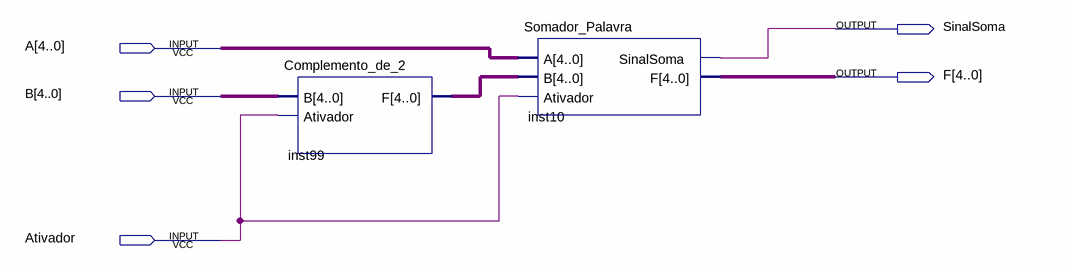
[diagram p0: schematic sheet]
// Quartus schematic Subtrator_Palavra.bdf as structural Verilog: 2 symbols, 5 pins
module Subtrator_Palavra (
  input  [4:0] A,
  input  [4:0] B,
  input  Ativador,
  output SinalSoma,
  output [4:0] F
);

  wire [4:0] inst99_f;

  Complemento_de_2 inst99 (.B(B), .Ativador(Ativador), .F(inst99_f));
  Somador_Palavra inst10 (.A(A), .B(inst99_f), .Ativador(Ativador), .SinalSoma(SinalSoma), .F(F));
endmodule
